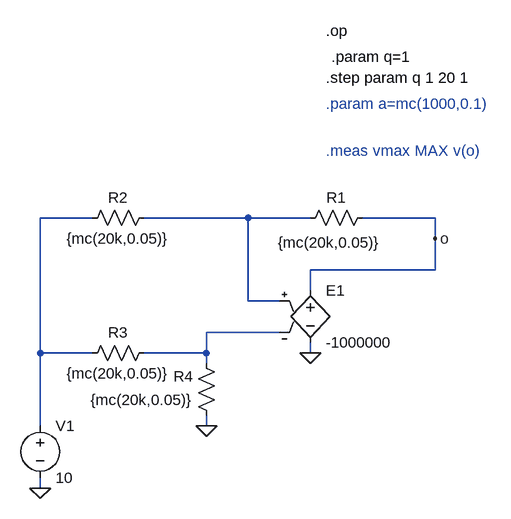
[diagram p0: schematic montecarlo2.asc]
montecarlo2.asc, the LTspice schematic file:
Version 4
SHEET 1 1124 680
WIRE -80 -16 -160 -16
WIRE 160 -16 0 -16
WIRE 256 -16 160 -16
WIRE 448 -16 336 -16
WIRE 448 16 448 -16
WIRE 448 64 448 16
WIRE 448 64 256 64
WIRE 256 96 256 64
WIRE 160 112 160 -16
WIRE 208 112 160 112
WIRE 208 160 96 160
WIRE -160 192 -160 -16
WIRE -80 192 -160 192
WIRE 96 192 96 160
WIRE 96 192 0 192
WIRE 256 192 256 176
WIRE 96 208 96 192
WIRE -160 304 -160 192
WIRE 96 304 96 288
WIRE -160 400 -160 384
FLAG 256 192 0
FLAG 96 304 0
FLAG -160 400 0
FLAG 448 16 o
SYMBOL e 256 80 R0
SYMATTR InstName E1
SYMATTR Value -1000000
SYMBOL res 352 -32 R90
WINDOW 0 0 56 VBottom 2
WINDOW 3 38 67 VTop 2
SYMATTR InstName R1
SYMATTR Value {mc(20k,0.05)}
SYMBOL res 16 -32 R90
WINDOW 0 0 56 VBottom 2
WINDOW 3 32 56 VTop 2
SYMATTR InstName R2
SYMATTR Value {mc(20k,0.05)}
SYMBOL res 16 176 R90
WINDOW 0 0 56 VBottom 2
WINDOW 3 32 56 VTop 2
SYMATTR InstName R3
SYMATTR Value {mc(20k,0.05)}
SYMBOL res 112 304 R180
WINDOW 0 36 76 Left 2
WINDOW 3 36 40 Left 2
SYMATTR InstName R4
SYMATTR Value {mc(20k,0.05)}
SYMBOL voltage -160 288 R0
WINDOW 123 0 0 Left 0
WINDOW 39 0 0 Left 0
SYMATTR InstName V1
SYMATTR Value 10
TEXT 280 -192 Left 2 ;.param a=mc(1000,0.1)
TEXT 280 -232 Left 2 !.step param q 1 20 1
TEXT 288 -264 Left 2 !.param q=1
TEXT 280 -120 Left 2 ;.meas vmax MAX v(o)
TEXT 280 -304 Left 2 !.op

The netlist it stands for:
* montecarlo2.asc
E1 o 0 N002 N003 -1000000
R1 o N002 {mc(20k,0.05)}
R2 N002 N001 {mc(20k,0.05)}
R3 N003 N001 {mc(20k,0.05)}
R4 0 N003 {mc(20k,0.05)}
V1 N001 0 10
* .param a=mc(1000,0.1)
.step param q 1 20 1
.param q=1
* .meas vmax MAX v(o)
.op
.backanno
.end